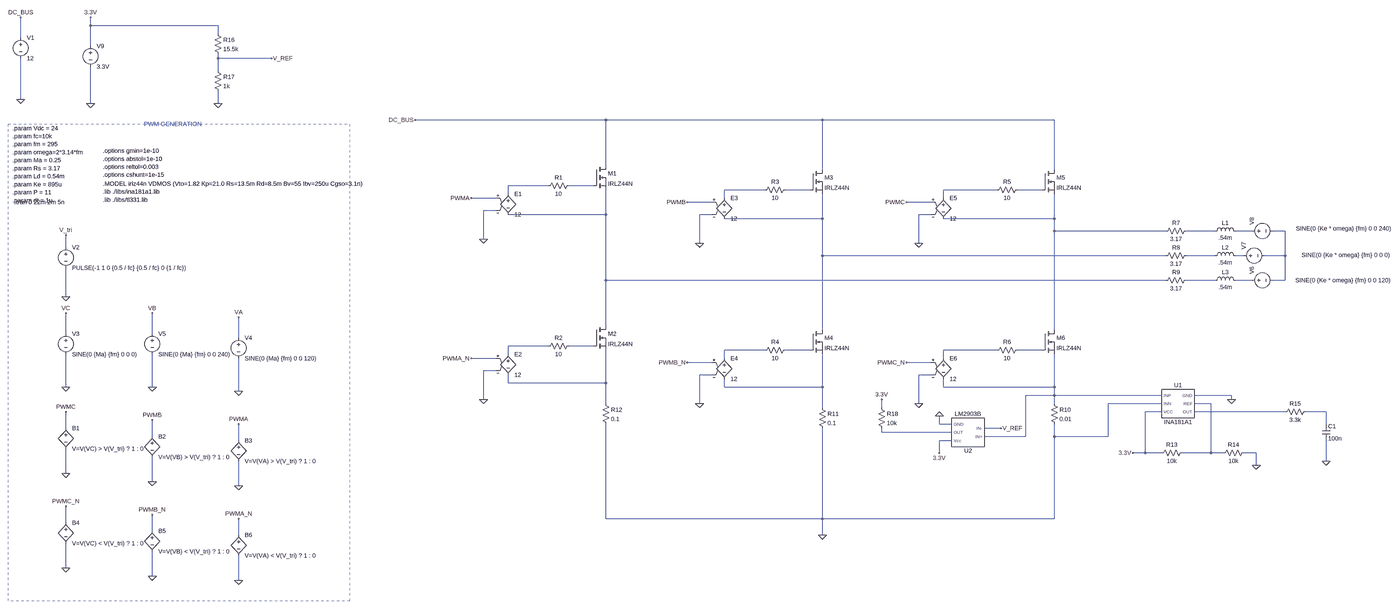
[diagram p0: schematic OCP_adc_protection.asc, whole sheet]
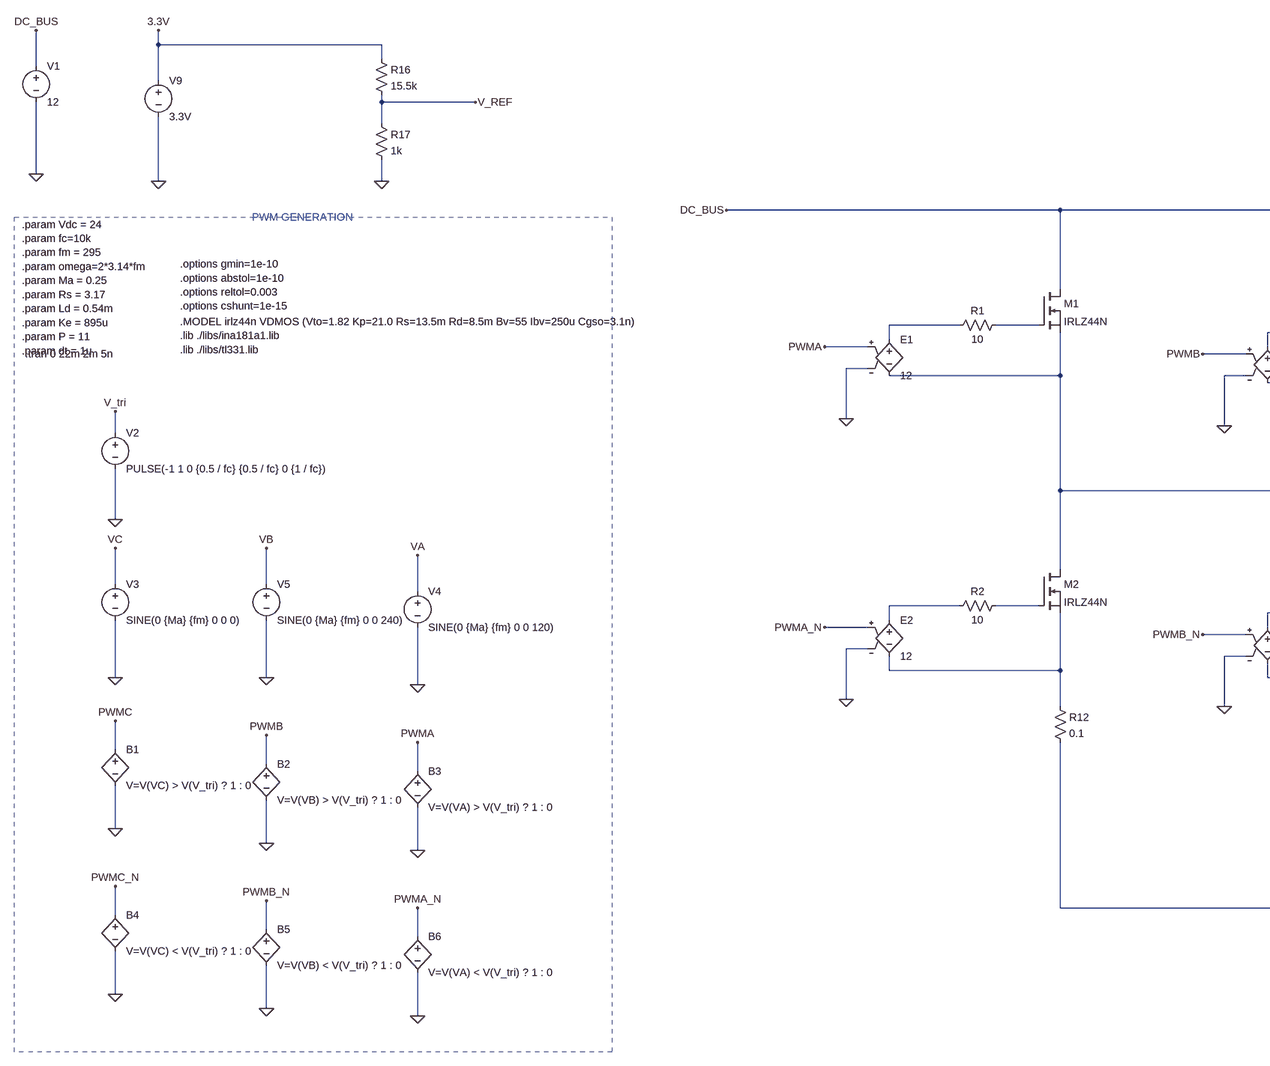
[diagram p1: schematic OCP_adc_protection.asc, part, row 1 of 1, column 1 of 2]
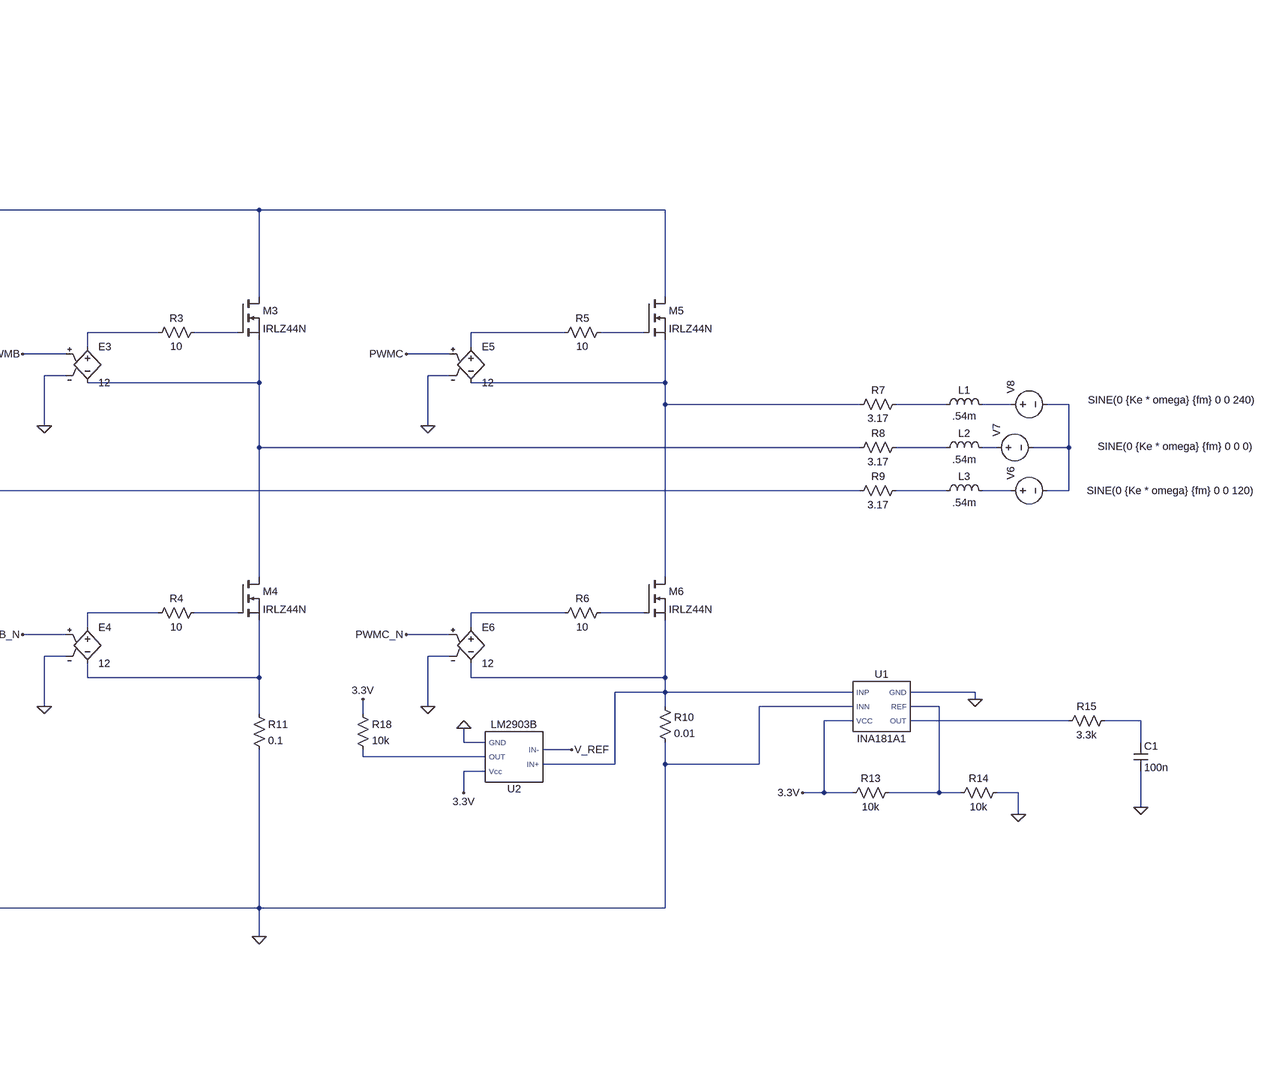
[diagram p2: schematic OCP_adc_protection.asc, part, row 1 of 1, column 2 of 2]
OCP_adc_protection.asc, the LTspice schematic file:
Version 4
SHEET 1 6180 2884
WIRE 80 320 80 288
WIRE 576 320 80 320
WIRE 576 352 576 320
WIRE -192 368 -192 288
WIRE 80 400 80 320
WIRE 576 448 576 432
WIRE 784 448 576 448
WIRE 576 496 576 448
WIRE -192 608 -192 448
WIRE 80 624 80 480
WIRE 576 624 576 576
WIRE 2640 688 1776 688
WIRE 3584 688 2640 688
WIRE 4560 688 3584 688
WIRE 2640 864 2640 688
WIRE 3584 880 3584 688
WIRE 4560 880 4560 688
WIRE 2416 944 2208 944
WIRE 2592 944 2496 944
WIRE 3360 960 3152 960
WIRE 3536 960 3440 960
WIRE 4336 960 4128 960
WIRE 4512 960 4416 960
WIRE 2208 976 2208 944
WIRE 2160 992 2064 992
WIRE 3152 992 3152 960
WIRE 4128 992 4128 960
WIRE 3104 1008 3008 1008
WIRE 4080 1008 3984 1008
WIRE 2160 1040 2112 1040
WIRE 2640 1056 2640 960
WIRE 2640 1056 2208 1056
WIRE 3104 1056 3056 1056
WIRE 4080 1056 4032 1056
WIRE 3584 1072 3584 976
WIRE 3584 1072 3152 1072
WIRE 4560 1072 4560 976
WIRE 4560 1072 4128 1072
WIRE 4560 1120 4560 1072
WIRE 5008 1120 4560 1120
WIRE 5200 1120 5088 1120
WIRE 5344 1120 5280 1120
WIRE 5472 1120 5424 1120
WIRE 2112 1152 2112 1040
WIRE 3056 1168 3056 1056
WIRE 4032 1168 4032 1056
WIRE -16 1184 -16 1136
WIRE 3584 1216 3584 1072
WIRE 5008 1216 3584 1216
WIRE 5200 1216 5088 1216
WIRE 5312 1216 5280 1216
WIRE 5472 1216 5472 1120
WIRE 5472 1216 5392 1216
WIRE 2640 1312 2640 1056
WIRE 5008 1312 2640 1312
WIRE 5200 1312 5088 1312
WIRE 5344 1312 5280 1312
WIRE 5472 1312 5472 1216
WIRE 5472 1312 5424 1312
WIRE -16 1376 -16 1264
WIRE 2640 1488 2640 1312
WIRE 3584 1504 3584 1216
WIRE 4560 1504 4560 1120
WIRE -16 1520 -16 1440
WIRE 320 1520 320 1440
WIRE 656 1536 656 1456
WIRE 2416 1568 2208 1568
WIRE 2592 1568 2496 1568
WIRE 3360 1584 3152 1584
WIRE 3536 1584 3440 1584
WIRE 4336 1584 4128 1584
WIRE 4512 1584 4416 1584
WIRE 2208 1600 2208 1568
WIRE 2160 1616 2064 1616
WIRE 3152 1616 3152 1584
WIRE 4128 1616 4128 1584
WIRE 3104 1632 3008 1632
WIRE 4080 1632 3984 1632
WIRE 2160 1664 2112 1664
WIRE 3104 1680 3056 1680
WIRE 4080 1680 4032 1680
WIRE 2208 1712 2208 1680
WIRE 2640 1712 2640 1584
WIRE 2640 1712 2208 1712
WIRE -16 1728 -16 1600
WIRE 320 1728 320 1600
WIRE 3152 1728 3152 1696
WIRE 3584 1728 3584 1600
WIRE 3584 1728 3152 1728
WIRE 4128 1728 4128 1696
WIRE 4560 1728 4560 1600
WIRE 4560 1728 4128 1728
WIRE 656 1744 656 1616
WIRE 4560 1760 4560 1728
WIRE 4560 1760 4448 1760
WIRE 4992 1760 4560 1760
WIRE 5264 1760 5120 1760
WIRE 2112 1776 2112 1664
WIRE 5264 1776 5264 1760
WIRE 2640 1792 2640 1712
WIRE 3056 1792 3056 1680
WIRE 4032 1792 4032 1680
WIRE 4560 1792 4560 1760
WIRE 4992 1792 4784 1792
WIRE 5184 1792 5120 1792
WIRE 3584 1808 3584 1728
WIRE 3888 1808 3888 1776
WIRE 4992 1824 4928 1824
WIRE 5472 1824 5120 1824
WIRE 5632 1824 5552 1824
WIRE 4112 1872 4112 1840
WIRE 4160 1872 4112 1872
WIRE 5632 1872 5632 1824
WIRE -16 1888 -16 1824
WIRE 4352 1888 4288 1888
WIRE 3888 1904 3888 1888
WIRE 4160 1904 3888 1904
WIRE 320 1920 320 1856
WIRE 4448 1920 4448 1760
WIRE 4448 1920 4288 1920
WIRE 4560 1920 4560 1872
WIRE 4784 1920 4784 1792
WIRE 4784 1920 4560 1920
WIRE 656 1936 656 1872
WIRE 4160 1936 4112 1936
WIRE 4112 1984 4112 1936
WIRE 4928 1984 4928 1824
WIRE 4928 1984 4880 1984
WIRE 4992 1984 4928 1984
WIRE 5184 1984 5184 1792
WIRE 5184 1984 5072 1984
WIRE 5232 1984 5184 1984
WIRE 5360 1984 5312 1984
WIRE 5632 2016 5632 1936
WIRE 5360 2032 5360 1984
WIRE -16 2064 -16 1968
WIRE 320 2096 320 2000
WIRE 656 2112 656 2016
WIRE 2640 2240 2640 1872
WIRE 3584 2240 3584 1888
WIRE 3584 2240 2640 2240
WIRE 4560 2240 4560 1920
WIRE 4560 2240 3584 2240
WIRE -16 2256 -16 2192
WIRE 320 2288 320 2224
WIRE 656 2304 656 2240
WIRE 3584 2304 3584 2240
WIRE -16 2432 -16 2336
WIRE 320 2464 320 2368
WIRE 656 2480 656 2384
FLAG -16 1136 V_tri
FLAG -16 1376 0
FLAG -16 1728 0
FLAG -16 1440 VC
FLAG 656 1744 0
FLAG 656 1456 VA
FLAG 320 1728 0
FLAG 320 1440 VB
FLAG -16 2064 0
FLAG -16 1824 PWMC
FLAG 320 2096 0
FLAG 320 1856 PWMB
FLAG 656 2112 0
FLAG 656 1872 PWMA
FLAG -16 2432 0
FLAG -16 2192 PWMC_N
FLAG 320 2464 0
FLAG 320 2224 PWMB_N
FLAG 656 2480 0
FLAG 656 2240 PWMA_N
FLAG -192 608 0
FLAG -192 288 DC_BUS
FLAG 2112 1152 0
FLAG 2064 992 PWMA
FLAG 1776 688 DC_BUS
FLAG 2112 1776 0
FLAG 2064 1616 PWMA_N
FLAG 3056 1168 0
FLAG 3008 1008 PWMB
FLAG 3056 1792 0
FLAG 3008 1632 PWMB_N
FLAG 4032 1168 0
FLAG 3984 1008 PWMC
FLAG 4032 1792 0
FLAG 3984 1632 PWMC_N
FLAG 3584 2304 0
FLAG 4880 1984 3.3V
FLAG 80 624 0
FLAG 80 288 3.3V
FLAG 5360 2032 0
FLAG 5632 2016 0
FLAG 5264 1776 0
FLAG 4112 1840 0
FLAG 4112 1984 3.3V
FLAG 4352 1888 V_REF
FLAG 576 624 0
FLAG 784 448 V_REF
FLAG 3888 1776 3.3V
SYMBOL voltage -16 1168 R0
WINDOW 123 0 0 Left 0
WINDOW 39 0 0 Left 0
SYMATTR InstName V2
SYMATTR Value PULSE(-1 1 0 {0.5 / fc} {0.5 / fc} 0 {1 / fc})
SYMBOL voltage -16 1504 R0
WINDOW 123 0 0 Left 0
WINDOW 39 0 0 Left 0
SYMATTR InstName V3
SYMATTR Value SINE(0 {Ma} {fm} 0 0 0)
SYMBOL voltage 656 1520 R0
WINDOW 123 0 0 Left 0
WINDOW 39 0 0 Left 0
SYMATTR InstName V4
SYMATTR Value SINE(0 {Ma} {fm} 0 0 120)
SYMBOL voltage 320 1504 R0
WINDOW 123 0 0 Left 0
WINDOW 39 0 0 Left 0
SYMATTR InstName V5
SYMATTR Value SINE(0 {Ma} {fm} 0 0 240)
SYMBOL bv -16 1872 R0
SYMATTR InstName B1
SYMATTR Value V=V(VC) > V(V_tri) ? 1 : 0
SYMBOL bv 320 1904 R0
SYMATTR InstName B2
SYMATTR Value V=V(VB) > V(V_tri) ? 1 : 0
SYMBOL bv 656 1920 R0
SYMATTR InstName B3
SYMATTR Value V=V(VA) > V(V_tri) ? 1 : 0
SYMBOL bv -16 2240 R0
SYMATTR InstName B4
SYMATTR Value V=V(VC) < V(V_tri) ? 1 : 0
SYMBOL bv 320 2272 R0
SYMATTR InstName B5
SYMATTR Value V=V(VB) < V(V_tri) ? 1 : 0
SYMBOL bv 656 2288 R0
SYMATTR InstName B6
SYMATTR Value V=V(VA) < V(V_tri) ? 1 : 0
SYMBOL voltage -192 352 R0
WINDOW 123 0 0 Left 0
WINDOW 39 0 0 Left 0
SYMATTR InstName V1
SYMATTR Value 12
SYMBOL e 2208 960 R0
SYMATTR InstName E1
SYMATTR Value 12
SYMBOL res 2512 928 R90
WINDOW 0 0 56 VBottom 2
WINDOW 3 32 56 VTop 2
SYMATTR InstName R1
SYMATTR Value 10
SYMBOL nmos 2592 864 R0
SYMATTR InstName M1
SYMATTR Value IRLZ44N
SYMBOL e 2208 1584 R0
SYMATTR InstName E2
SYMATTR Value 12
SYMBOL res 2512 1552 R90
WINDOW 0 0 56 VBottom 2
WINDOW 3 32 56 VTop 2
SYMATTR InstName R2
SYMATTR Value 10
SYMBOL nmos 2592 1488 R0
SYMATTR InstName M2
SYMATTR Value IRLZ44N
SYMBOL e 3152 976 R0
SYMATTR InstName E3
SYMATTR Value 12
SYMBOL res 3456 944 R90
WINDOW 0 0 56 VBottom 2
WINDOW 3 32 56 VTop 2
SYMATTR InstName R3
SYMATTR Value 10
SYMBOL nmos 3536 880 R0
SYMATTR InstName M3
SYMATTR Value IRLZ44N
SYMBOL e 3152 1600 R0
SYMATTR InstName E4
SYMATTR Value 12
SYMBOL res 3456 1568 R90
WINDOW 0 0 56 VBottom 2
WINDOW 3 32 56 VTop 2
SYMATTR InstName R4
SYMATTR Value 10
SYMBOL nmos 3536 1504 R0
SYMATTR InstName M4
SYMATTR Value IRLZ44N
SYMBOL e 4128 976 R0
SYMATTR InstName E5
SYMATTR Value 12
SYMBOL res 4432 944 R90
WINDOW 0 0 56 VBottom 2
WINDOW 3 32 56 VTop 2
SYMATTR InstName R5
SYMATTR Value 10
SYMBOL nmos 4512 880 R0
SYMATTR InstName M5
SYMATTR Value IRLZ44N
SYMBOL e 4128 1600 R0
SYMATTR InstName E6
SYMATTR Value 12
SYMBOL res 4432 1568 R90
WINDOW 0 0 56 VBottom 2
WINDOW 3 32 56 VTop 2
SYMATTR InstName R6
SYMATTR Value 10
SYMBOL nmos 4512 1504 R0
SYMATTR InstName M6
SYMATTR Value IRLZ44N
SYMBOL res 5104 1104 R90
WINDOW 0 0 56 VBottom 2
WINDOW 3 32 56 VTop 2
SYMATTR InstName R7
SYMATTR Value 3.17
SYMBOL ind 5184 1136 R270
WINDOW 0 32 56 VTop 2
WINDOW 3 5 56 VBottom 2
SYMATTR InstName L1
SYMATTR Value .54m
SYMBOL res 5104 1200 R90
WINDOW 0 0 56 VBottom 2
WINDOW 3 32 56 VTop 2
SYMATTR InstName R8
SYMATTR Value 3.17
SYMBOL ind 5184 1232 R270
WINDOW 0 32 56 VTop 2
WINDOW 3 5 56 VBottom 2
SYMATTR InstName L2
SYMATTR Value .54m
SYMBOL res 5104 1296 R90
WINDOW 0 0 56 VBottom 2
WINDOW 3 32 56 VTop 2
SYMATTR InstName R9
SYMATTR Value 3.17
SYMBOL ind 5184 1328 R270
WINDOW 0 32 56 VTop 2
WINDOW 3 5 56 VBottom 2
SYMATTR InstName L3
SYMATTR Value .54m
SYMBOL res 4544 1776 R0
SYMATTR InstName R10
SYMATTR Value 0.01
SYMBOL res 3568 1792 R0
SYMATTR InstName R11
SYMATTR Value 0.1
SYMBOL res 2624 1776 R0
SYMATTR InstName R12
SYMATTR Value 0.1
SYMBOL voltage 5328 1312 R270
WINDOW 123 0 0 Left 0
WINDOW 39 0 0 Left 0
WINDOW 3 0 184 VRight 2
SYMATTR Value SINE(0 {Ke * omega} {fm} 0 0 120)
SYMATTR InstName V6
SYMBOL voltage 80 384 R0
WINDOW 123 0 0 Left 0
WINDOW 39 0 0 Left 0
SYMATTR InstName V9
SYMATTR Value 3.3V
SYMBOL res 4976 2000 R270
WINDOW 0 32 56 VTop 2
WINDOW 3 0 56 VBottom 2
SYMATTR InstName R13
SYMATTR Value 10k
SYMBOL res 5568 1808 R90
WINDOW 0 0 56 VBottom 2
WINDOW 3 32 56 VTop 2
SYMATTR InstName R15
SYMATTR Value 3.3k
SYMBOL cap 5616 1872 R0
SYMATTR InstName C1
SYMATTR Value 100n
SYMBOL voltage 5296 1216 R270
WINDOW 123 0 0 Left 0
WINDOW 39 0 0 Left 0
WINDOW 3 2 240 VRight 2
SYMATTR Value SINE(0 {Ke * omega} {fm} 0 0 0)
SYMATTR InstName V7
SYMBOL voltage 5328 1120 R270
WINDOW 123 0 0 Left 0
WINDOW 39 0 0 Left 0
WINDOW 3 10 187 VRight 2
SYMATTR Value SINE(0 {Ke * omega} {fm} 0 0 240)
SYMATTR InstName V8
SYMBOL res 5328 1968 R90
WINDOW 0 0 56 VBottom 2
WINDOW 3 32 56 VTop 2
SYMATTR InstName R14
SYMATTR Value 10k
SYMBOL INA181A1 5056 1792 R0
SYMATTR InstName U1
SYMBOL LM2903B 4224 1904 R180
SYMATTR InstName U2
SYMATTR Value LM2903B
SYMBOL res 560 336 R0
SYMATTR InstName R16
SYMATTR Value 15.5k
SYMBOL res 560 480 R0
SYMATTR InstName R17
SYMATTR Value 1k
SYMBOL res 3872 1792 R0
SYMATTR InstName R18
SYMATTR Value 10k
TEXT -224 720 Left 2 !.param Vdc = 24\n.param fc=10k\n.param fm = 295\n.param omega=2*3.14*fm\n.param Ma = 0.25\n.param Rs = 3.17\n.param Ld = 0.54m\n.param Ke = 895u\n.param P = 11\n.param dt = 1u
TEXT -216 1008 Left 2 !.tran 0 22m 2m 5n
TEXT 288 704 Left 2 ;PWM GENERATION
TEXT 128 936 Left 2 !.MODEL irlz44n VDMOS (Vto=1.82 Kp=21.0 Rs=13.5m Rd=8.5m Bv=55 Ibv=250u Cgso=3.1n)\n.lib ./libs/ina181a1.lib\n.lib ./libs/tl331.lib
TEXT 128 808 Left 2 !.options gmin=1e-10\n.options abstol=1e-10\n.options reltol=0.003\n.options cshunt=1e-15
RECTANGLE Normal 1088 2560 -240 704 2

The netlist it stands for:
* OCP_adc_protection.asc
V2 V_tri 0 PULSE(-1 1 0 {0.5 / fc} {0.5 / fc} 0 {1 / fc})
V3 VC 0 SINE(0 {Ma} {fm} 0 0 0)
V4 VA 0 SINE(0 {Ma} {fm} 0 0 120)
V5 VB 0 SINE(0 {Ma} {fm} 0 0 240)
B1 PWMC 0 V=V(VC) > V(V_tri) ? 1 : 0
B2 PWMB 0 V=V(VB) > V(V_tri) ? 1 : 0
B3 PWMA 0 V=V(VA) > V(V_tri) ? 1 : 0
B4 PWMC_N 0 V=V(VC) < V(V_tri) ? 1 : 0
B5 PWMB_N 0 V=V(VB) < V(V_tri) ? 1 : 0
B6 PWMA_N 0 V=V(VA) < V(V_tri) ? 1 : 0
V1 DC_BUS 0 12
E1 N001 N007 PWMA 0 12
R1 N002 N001 10
M1 DC_BUS N002 N007 N007 IRLZ44N
E2 N017 N023 PWMA_N 0 12
R2 N018 N017 10
M2 N007 N018 N023 N023 IRLZ44N
E3 N003 N008 PWMB 0 12
R3 N004 N003 10
M3 DC_BUS N004 N008 N008 IRLZ44N
E4 N019 N024 PWMB_N 0 12
R4 N020 N019 10
M4 N008 N020 N024 N024 IRLZ44N
E5 N005 N009 PWMC 0 12
R5 N006 N005 10
M5 DC_BUS N006 N009 N009 IRLZ44N
E6 N021 N025 PWMC_N 0 12
R6 N022 N021 10
M6 N009 N022 N025 N025 IRLZ44N
R7 N010 N009 3.17
L1 N010 N011 .54m
R8 N013 N008 3.17
L2 N013 N014 .54m
R9 N015 N007 3.17
L3 N015 N016 .54m
R10 N025 0 0.01
R11 N024 0 0.1
R12 N023 0 0.1
V6 N016 N012 SINE(0 {Ke * omega} {fm} 0 0 120)
V9 3.3V 0 3.3V
R13 3.3V N026 10k
R15 N028 N027 3.3k
C1 N028 0 100n
V7 N014 N012 SINE(0 {Ke * omega} {fm} 0 0 0)
V8 N011 N012 SINE(0 {Ke * omega} {fm} 0 0 240)
R14 0 N026 10k
XU1 N025 0 3.3V 0 N026 N027 INA181A1  ; pins INP INN VCC GND REF OUT
XU2 N025 V_REF 3.3V 0 N029 LM2903B  ; pins IN+ IN- Vcc GND OUT
R16 3.3V V_REF 15.5k
R17 V_REF 0 1k
R18 3.3V N029 10k
.model NMOS NMOS
.model PMOS PMOS
.lib standard.mos
.param Vdc = 24
.param fc=10k
.param fm = 295
.param omega=2*3.14*fm
.param Ma = 0.25
.param Rs = 3.17
.param Ld = 0.54m
.param Ke = 895u
.param P = 11
.param dt = 1u
.tran 0 22m 2m 5n
* PWM GENERATION
.MODEL irlz44n VDMOS (Vto=1.82 Kp=21.0 Rs=13.5m Rd=8.5m Bv=55 Ibv=250u Cgso=3.1n)
.lib ./libs/ina181a1.lib
.lib ./libs/tl331.lib
.options gmin=1e-10
.options abstol=1e-10
.options reltol=0.003
.options cshunt=1e-15
.lib C:\Users\abdab\Documents\Capstone\BLDC-motor-custom-inverter\SPICE\libs\ina181a1.lib
.lib C:\Users\abdab\Documents\Capstone\BLDC-motor-custom-inverter\SPICE\libs\tl331.lib
.backanno
.end